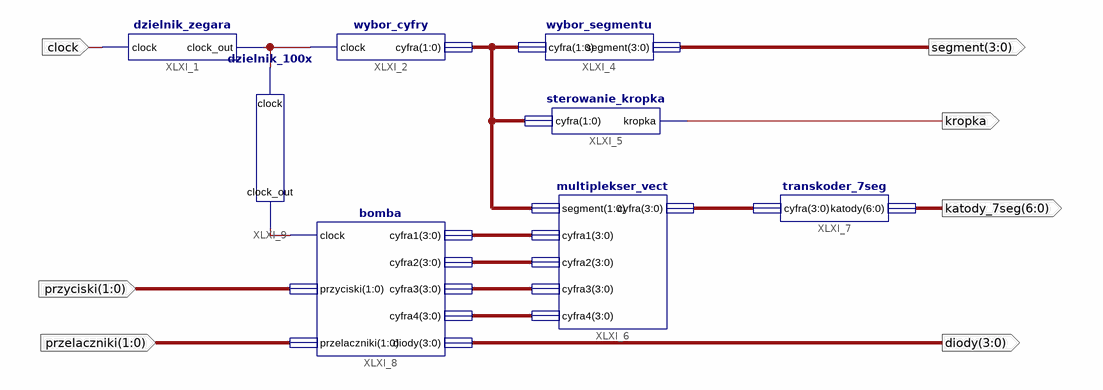
[diagram p0: schematic sheet 1]
// Xilinx ISE schematic main.sch (xbr) as structural Verilog: 8 symbols, 7 ports
module main (
  input  clock,
  input  [1:0] przyciski,
  input  [1:0] przelaczniki,
  output [3:0] segment,
  output kropka,
  output [6:0] katody_7seg,
  output [3:0] diody
);

  wire XLXN_20, XLXN_28;
  wire [1:0] XLXN_10;
  wire [3:0] XLXN_12, XLXN_16, XLXN_17, XLXN_18, XLXN_19;

  dzielnik_zegara XLXI_1 (.clock(clock), .clock_out(XLXN_28));
  wybor_cyfry XLXI_2 (.clock(XLXN_28), .cyfra(XLXN_10));
  wybor_segmentu XLXI_4 (.cyfra(XLXN_10), .segment(segment));
  sterowanie_kropka XLXI_5 (.cyfra(XLXN_10), .kropka(kropka));
  multiplekser_vect XLXI_6 (
    .segment(XLXN_10), .cyfra1(XLXN_16), .cyfra2(XLXN_17), .cyfra3(XLXN_18), .cyfra4(XLXN_19), .cyfra(XLXN_12));
  transkoder_7seg XLXI_7 (.cyfra(XLXN_12), .katody(katody_7seg));
  bomba XLXI_8 (
    .clock(XLXN_20), .przyciski(przyciski), .przelaczniki(przelaczniki), .cyfra1(XLXN_16), .cyfra2(XLXN_17),
    .cyfra3(XLXN_18), .cyfra4(XLXN_19), .diody(diody));
  dzielnik_100x XLXI_9 (.clock(XLXN_28), .clock_out(XLXN_20));
endmodule
